# EAGLE board yacc1 (EAGLE 6.5.0)
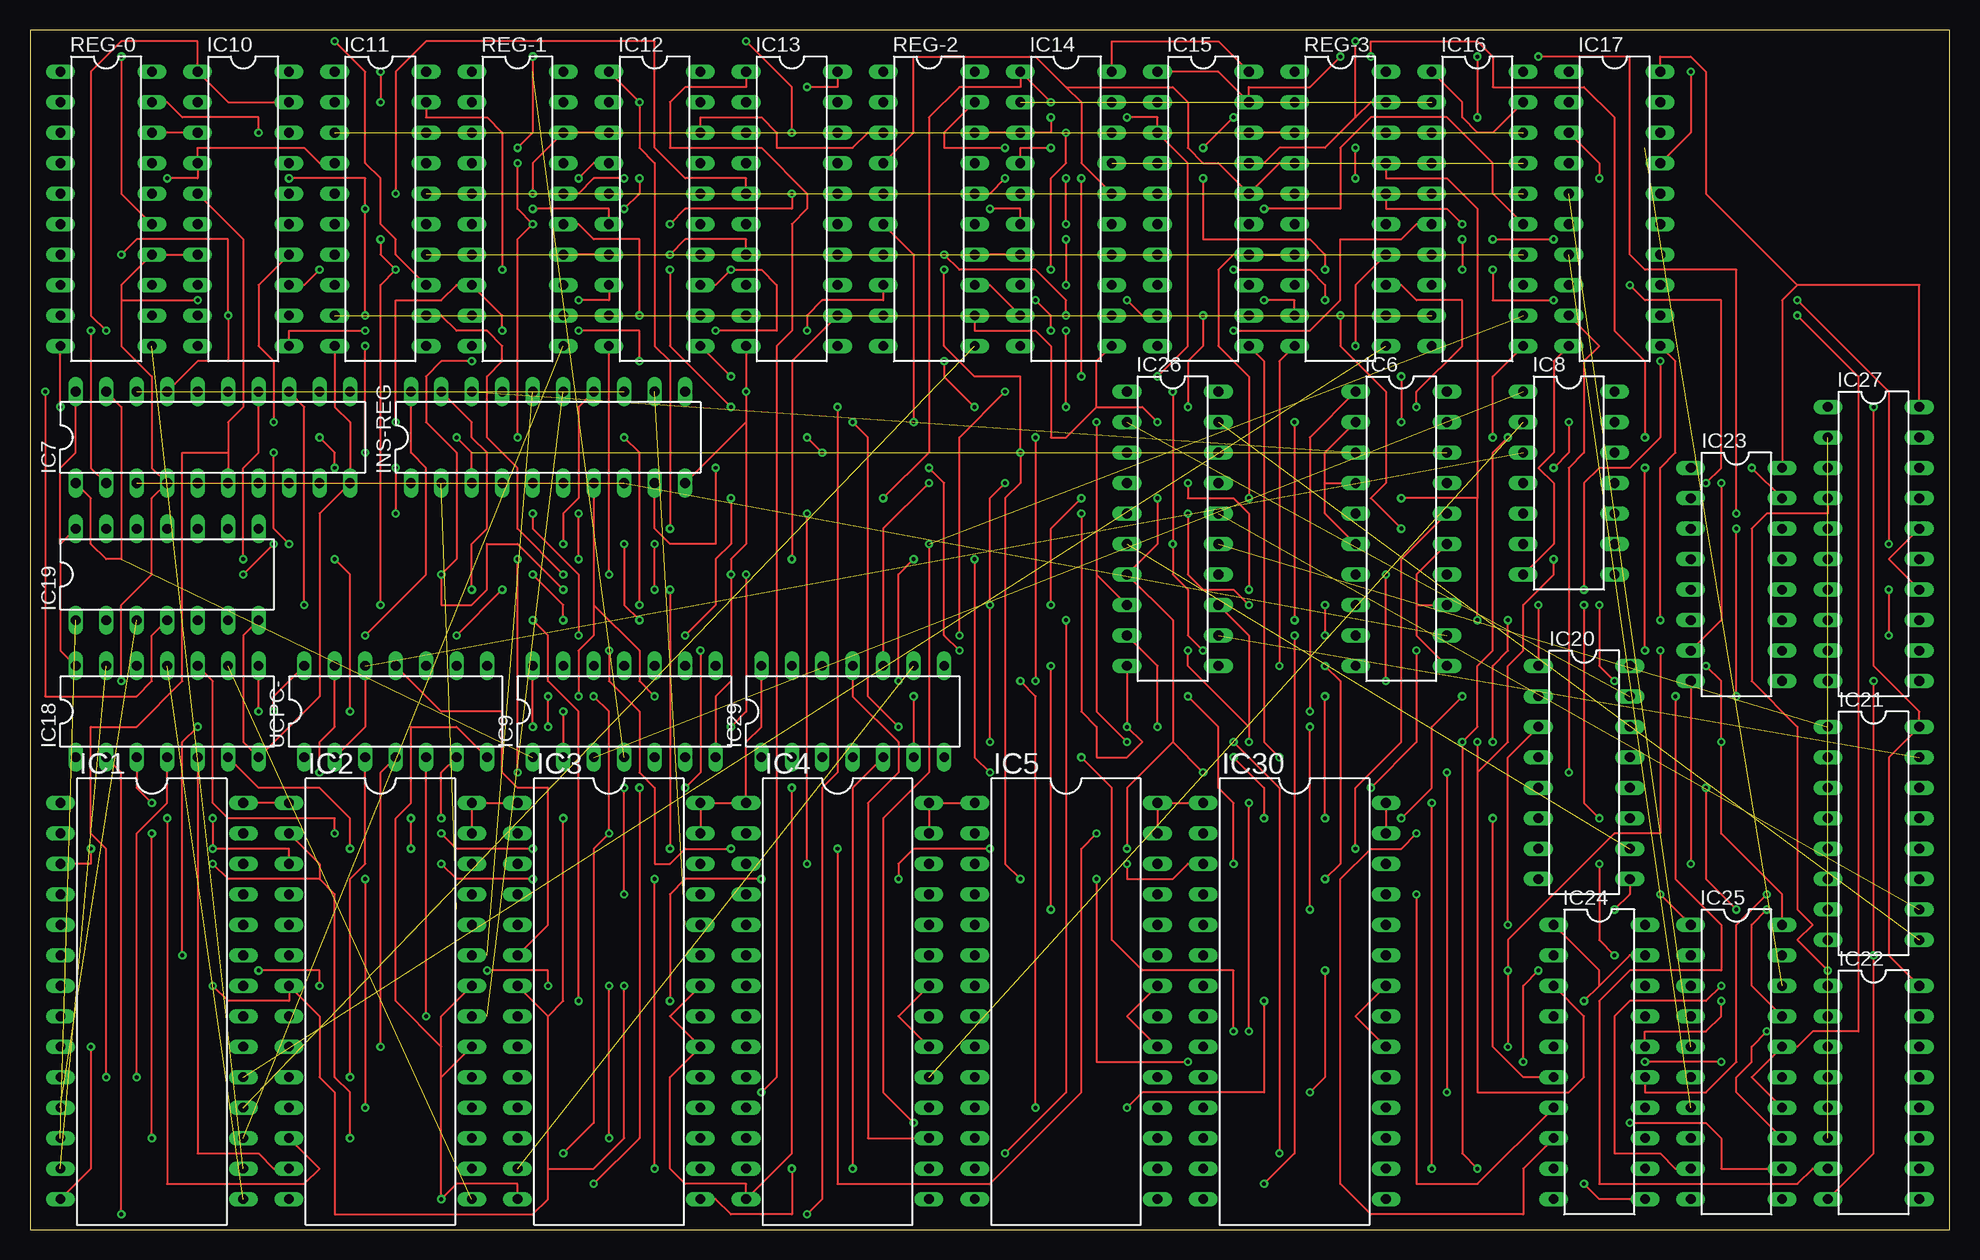
[diagram p3: board, top side]
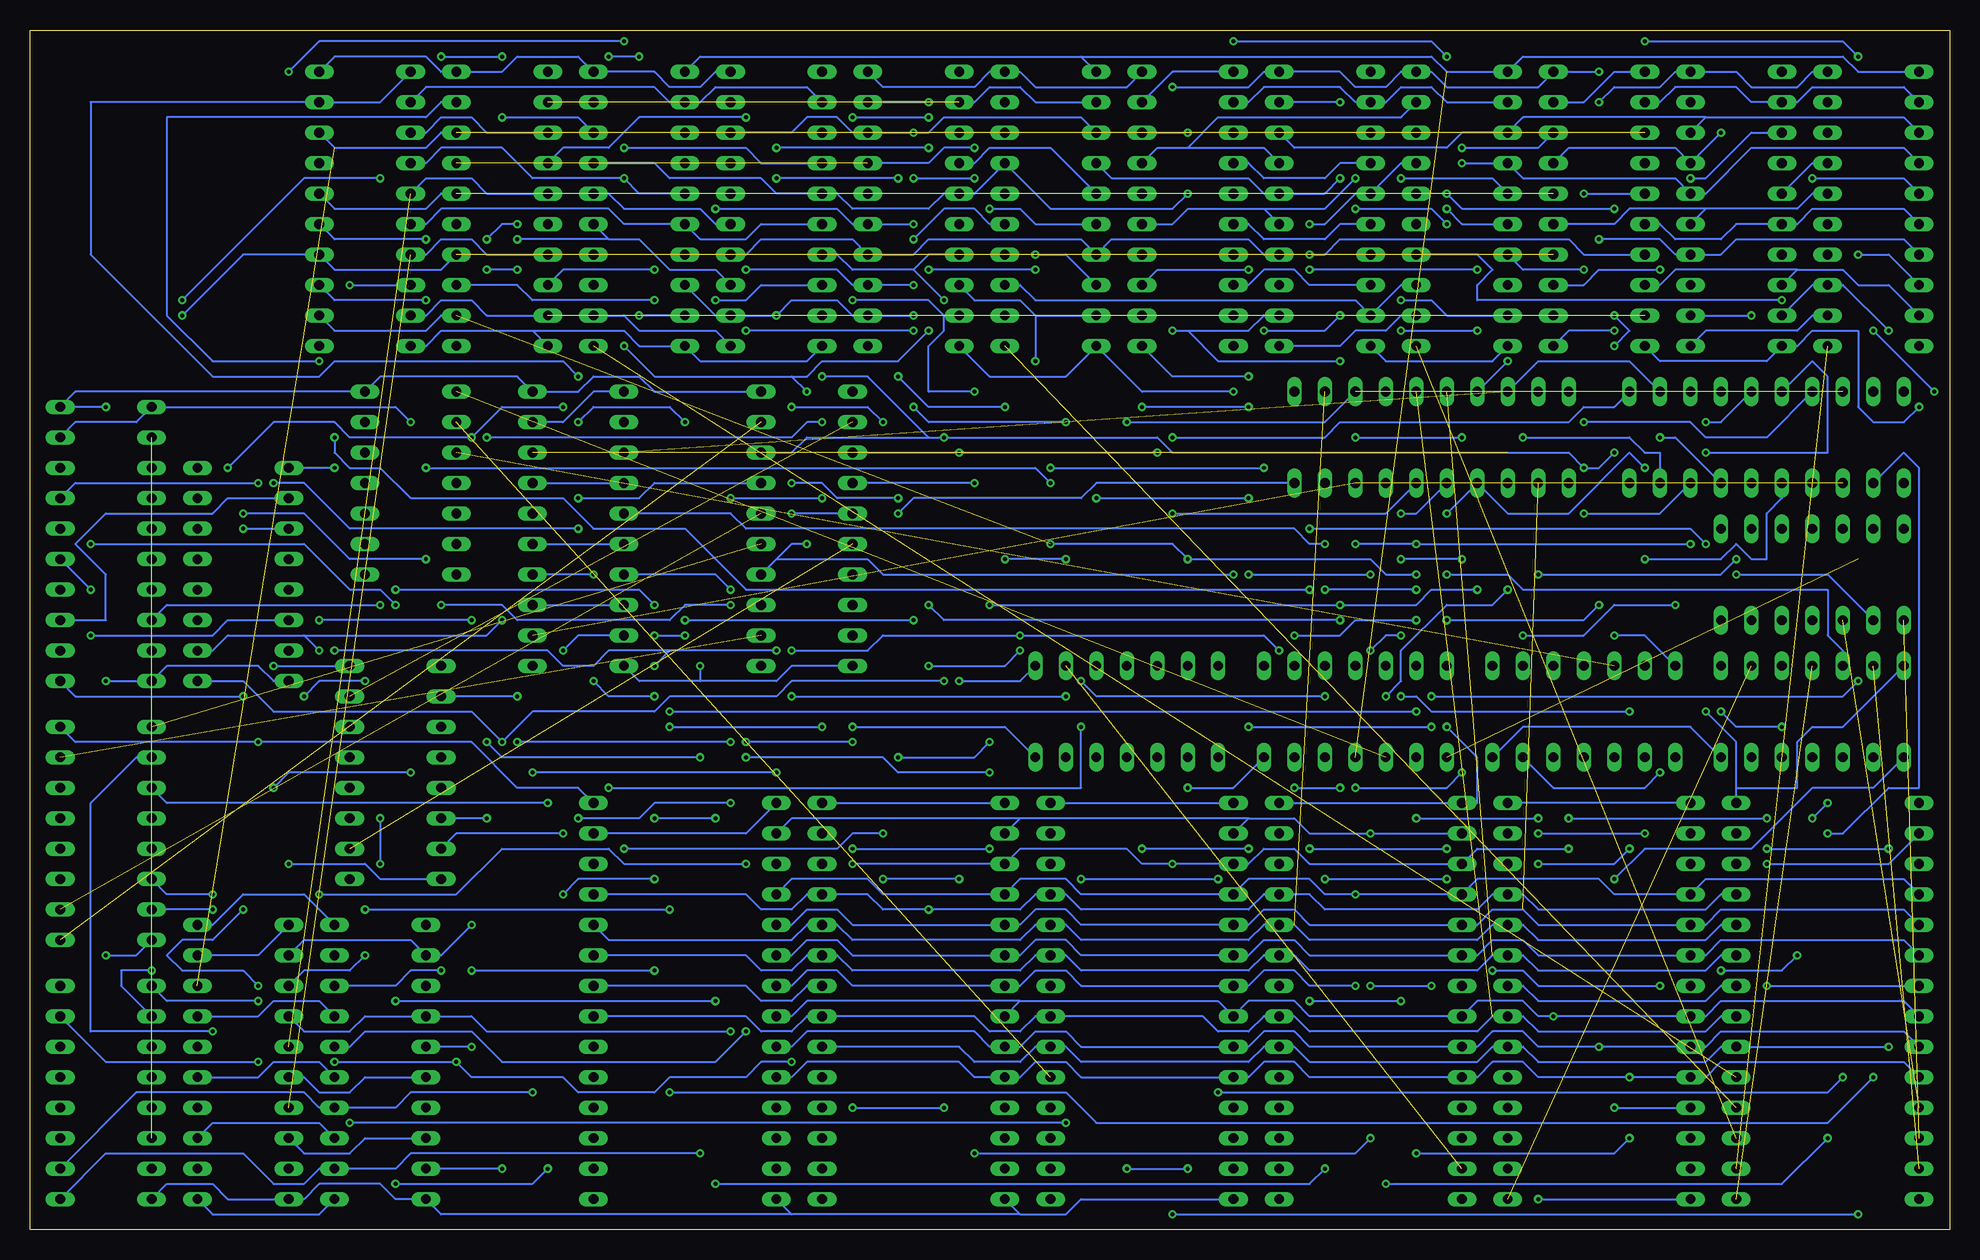
[diagram p4: board, bottom side, seen from below]

Size 160 x 100 mm. Coordinates in mm from the lower left corner, seen from the top.
Outline: 0,0 160,0 160,100 0,100 0,0
Copper layers (1*16): Top 0.0356mm / dielectric 1.5011mm / Bottom 0.0356mm
Design rules "oshpark-2layer": minimum track width 6mil, minimum drill 13mil, track to track 6mil, track to pad 6mil, pad to pad 6mil, via to via 6mil, smd to smd 6mil, copper to edge 15mil, drill to drill 6mil, minimum pad ring 7mil, minimum via ring 7mil, stop-mask expansion 4mil, vias tented up to drill 0mil, thermal gap 10mil

## Footprints (pad centres in the part's own frame; a part is rotated, then mirrored left to right if it is on the bottom)
DIL28-6 = drill 0.813 long: 1 -16.51,-7.62; 2 -13.97,-7.62; 3 -11.43,-7.62; 4 -8.89,-7.62; 5 -6.35,-7.62; 6 -3.81,-7.62; 7 -1.27,-7.62; 8 1.27,-7.62; 9 3.81,-7.62; 10 6.35,-7.62; 11 8.89,-7.62; 12 11.43,-7.62; 13 13.97,-7.62; 14 16.51,-7.62; 15 16.51,7.62; 16 13.97,7.62; 17 11.43,7.62; 18 8.89,7.62; 19 6.35,7.62; 20 3.81,7.62; 21 1.27,7.62; 22 -1.27,7.62; 23 -3.81,7.62; 24 -6.35,7.62; 25 -8.89,7.62; 26 -11.43,7.62; 27 -13.97,7.62; 28 -16.51,7.62
DIL20 = drill 0.813 long: 1 -11.43,-3.81; 2 -8.89,-3.81; 3 -6.35,-3.81; 4 -3.81,-3.81; 5 -1.27,-3.81; 6 1.27,-3.81; 7 3.81,-3.81; 8 6.35,-3.81; 9 8.89,-3.81; 10 11.43,-3.81; 11 11.43,3.81; 12 8.89,3.81; 13 6.35,3.81; 14 3.81,3.81; 15 1.27,3.81; 16 -1.27,3.81; 17 -3.81,3.81; 18 -6.35,3.81; 19 -8.89,3.81; 20 -11.43,3.81
DIL14 = drill 0.813 long: 1 -7.62,-3.81; 2 -5.08,-3.81; 3 -2.54,-3.81; 4 0,-3.81; 5 2.54,-3.81; 6 5.08,-3.81; 7 7.62,-3.81; 8 7.62,3.81; 9 5.08,3.81; 10 2.54,3.81; 11 0,3.81; 12 -2.54,3.81; 13 -5.08,3.81; 14 -7.62,3.81
DIL16 = drill 0.813 long: 1 -8.89,-3.81; 2 -6.35,-3.81; 3 -3.81,-3.81; 4 -1.27,-3.81; 5 1.27,-3.81; 6 3.81,-3.81; 7 6.35,-3.81; 8 8.89,-3.81; 9 8.89,3.81; 10 6.35,3.81; 11 3.81,3.81; 12 1.27,3.81; 13 -1.27,3.81; 14 -3.81,3.81; 15 -6.35,3.81; 16 -8.89,3.81

## Placement (x,y rotation side)
IC1  27C64P  [DIL28-6]  10.16,19.05 270 top
IC2  27C64P  [DIL28-6]  29.21,19.05 270 top
IC3  27C64P  [DIL28-6]  48.26,19.05 270 top
IC4  27C64P  [DIL28-6]  67.31,19.05 270 top
IC5  27C64P  [DIL28-6]  86.36,19.05 270 top
IC6  74LS244N  [DIL20]  114.3,58.42 270 top
IC7  74LS244N  [DIL20]  15.24,66.04 0 top
IC8  74LS32N  [DIL14]  128.27,62.23 270 top
IC9  74AS04N  [DIL14]  49.53,43.18 0 top
IC10  74LS244N  [DIL20]  17.78,85.09 270 top
IC11  74LS244N  [DIL20]  29.21,85.09 270 top
IC12  74LS244N  [DIL20]  52.07,85.09 270 top
IC13  74LS244N  [DIL20]  63.5,85.09 270 top
IC14  74LS244N  [DIL20]  86.36,85.09 270 top
IC15  74LS244N  [DIL20]  97.79,85.09 270 top
IC16  74LS244N  [DIL20]  120.65,85.09 270 top
IC17  74LS244N  [DIL20]  132.08,85.09 270 top
IC18  74ALS04N  [DIL14]  11.43,43.18 0 top
IC19  74ALS04N  [DIL14]  11.43,54.61 0 top
IC20  74LS191N  [DIL16]  129.54,38.1 270 top
IC21  74LS191N  [DIL16]  153.67,33.02 270 top
IC22  74LS191N  [DIL16]  153.67,11.43 270 top
IC23  74LS191N  [DIL16]  142.24,54.61 270 top
IC24  74LS244N  [DIL20]  130.81,13.97 270 top
IC25  74LS244N  [DIL20]  142.24,13.97 270 top
IC26  74273N  [DIL20]  95.25,58.42 270 top
IC27  74LS244N  [DIL20]  153.67,57.15 270 top
IC29  74LS04N  [DIL14]  68.58,43.18 0 top
IC30  27C64P  [DIL28-6]  105.41,19.05 270 top
INS-REG  74273N  [DIL20]  43.18,66.04 0 top
REG-0  74273N  [DIL20]  6.35,85.09 270 top
REG-1  74273N  [DIL20]  40.64,85.09 270 top
REG-2  74273N  [DIL20]  74.93,85.09 270 top
REG-3  74273N  [DIL20]  109.22,85.09 270 top
UCPC-  74AC393N  [DIL14]  30.48,43.18 0 top

## Tracks (layer width: path | path; a pad name or v marks a point on that pad's centre or on a via)
5V
  Top 0.152: IC6.2 107.95,64.77 107.95,62.23 | 107.95,62.23 107.95,59.69 IC6.6 | IC6.11 115.57,49.53 115.57,52.07 | 115.57,52.07 115.57,54.61 IC6.15 | 115.57,52.07 IC6.13 | 107.95,62.23 IC6.4
  Bottom 0.152: IC6.17 IC6.4 | IC6.13 IC6.8 | IC6.15 IC6.6
-DO-INT  (via drill 0.33)
  Top 0.152: v44.45,43.18 IC9.2 | v106.68,43.18 106.68,66.04 IC6.1
  Bottom 0.152: v106.68,43.18 v44.45,43.18 | IC6.19 115.57,67.31 113.03,69.85 IC6.1
-RESET  (1 unrouted)
  Bottom 0.152: REG-0.1 7.62,96.52 8.89,97.79 35.56,97.79 REG-1.1 41.91,96.52 43.18,97.79 72.39,97.79 | 72.39,97.79 REG-2.1 | 72.39,97.79 104.14,97.79 REG-3.1
ADDR0  (via drill 0.33)  (2 unrouted)
  Top 0.152: v40.64,90.17 41.91,91.44 v41.91,97.79 | v59.69,99.06 63.5,95.25 v63.5,91.44
  Bottom 0.152: IC16.18 125.73,91.44 127,90.17 134.62,90.17 IC17.18 | IC11.18 34.29,90.17 v40.64,90.17 | v41.91,97.79 43.18,99.06 v59.69,99.06 | IC13.18 v63.5,91.44
ADDR1  (2 unrouted)
  Bottom 0.152: IC16.16 125.73,86.36 127,85.09 134.62,85.09 IC17.16
ADDR2  (via drill 0.33)  (2 unrouted)
  Top 0.152: IC25.14 143.51,12.7 IC25.16 147.32,15.24 148.59,16.51 152.4,16.51 152.4,71.12 v147.32,76.2
  Bottom 0.152: IC16.14 125.73,80.01 134.62,80.01 IC17.14 142.24,81.28 v147.32,76.2
ADDR3  (via drill 0.33)  (1 unrouted)
  Top 0.152: IC11.12 34.29,76.2 35.56,74.93 38.1,74.93 39.37,73.66 39.37,72.39 38.1,71.12 38.1,66.04 40.64,63.5 40.64,58.42 v44.45,54.61 | v63.5,55.88 63.5,72.39 IC13.12 | IC25.12 140.97,5.08 140.97,7.62 139.7,8.89 v133.35,8.89 | v73.66,8.89 71.12,11.43 71.12,34.29 74.93,38.1 v74.93,57.15
  Bottom 0.152: v44.45,54.61 46.99,54.61 48.26,55.88 v63.5,55.88 64.77,57.15 v74.93,57.15 | v73.66,8.89 v133.35,8.89 | IC16.12 125.73,76.2 127,74.93 134.62,74.93 IC17.12
ADDR4  (via drill 0.33)  (2 unrouted)
  Top 0.152: IC25.9 137.16,5.08 135.89,6.35 132.08,6.35 132.08,17.78 133.35,19.05 139.7,19.05 v140.97,20.32 | v142.24,26.67 139.7,29.21 v139.7,36.83 | v128.27,38.1 128.27,63.5 129.54,64.77 129.54,72.39 130.81,73.66 IC17.9
  Bottom 0.152: IC16.9 121.92,76.2 123.19,77.47 125.73,77.47 127,76.2 IC17.9 | v140.97,20.32 142.24,21.59 147.32,21.59 148.59,22.86 147.32,24.13 144.78,24.13 v142.24,26.67 | v139.7,36.83 138.43,38.1 v128.27,38.1
ADDR5  (via drill 0.33)  (2 unrouted)
  Top 0.152: v53.34,81.28 54.61,82.55 59.69,82.55 IC13.7
  Bottom 0.152: IC16.7 121.92,81.28 123.19,82.55 125.73,82.55 127,81.28 IC17.7 | IC11.7 30.48,81.28 31.75,82.55 50.8,82.55 52.07,81.28 v53.34,81.28
ADDR6  (via drill 0.33)  (2 unrouted)
  Top 0.152: v30.48,86.36 30.48,96.52 33.02,99.06 52.07,99.06 52.07,90.17 54.61,87.63 59.69,87.63 IC13.5
  Bottom 0.152: IC16.5 121.92,86.36 123.19,87.63 127,87.63 IC17.5 | v30.48,86.36 IC11.5
ADDR7  (via drill 0.33)  (2 unrouted)
  Top 0.152: v132.08,22.86 130.81,24.13 v130.81,30.48 | v130.81,34.29 129.54,35.56 v129.54,52.07 | v154.94,57.15 154.94,69.85 v147.32,77.47 | v130.81,87.63 130.81,88.9 IC17.3
  Bottom 0.152: IC16.3 121.92,91.44 123.19,92.71 125.73,92.71 127,91.44 IC17.3 | IC25.3 137.16,21.59 133.35,21.59 v132.08,22.86 | v130.81,34.29 v130.81,30.48 | v129.54,52.07 130.81,53.34 133.35,53.34 137.16,57.15 v154.94,57.15 | v147.32,77.47 137.16,87.63 v130.81,87.63
ADDR9
  Top 0.152: IC27.14 154.94,55.88 IC27.16
BRANCH0  (1 unrouted)
BRANCH1  (via drill 0.33)
  Top 0.152: v125.73,52.07 IC20.1 | v101.6,52.07 100.33,53.34 97.79,53.34 96.52,54.61 v96.52,59.69
  Bottom 0.152: v125.73,52.07 120.65,52.07 119.38,50.8 106.68,50.8 105.41,52.07 v101.6,52.07 | IC26.5 v96.52,59.69
BRANCH2  (1 unrouted)
BRANCH3  (via drill 0.33)
  Top 0.152: IC26.9 93.98,46.99 v93.98,41.91 | v106.68,26.67 v106.68,41.91 | v132.08,26.67 133.35,27.94 IC20.9
  Bottom 0.152: v106.68,41.91 v93.98,41.91 | v132.08,26.67 v106.68,26.67
BRANCH4  (1 unrouted)
BRANCH5  (1 unrouted)
BRANCH6  (1 unrouted)
BRANCH7  (1 unrouted)
DATA0  (via drill 0.33)
  Top 0.152: REG-3.3 IC15.18 | REG-2.3 69.85,91.44 68.58,90.17 62.23,90.17 62.23,91.44 60.96,92.71 55.88,92.71 IC12.18 | v125.73,21.59 124.46,20.32 v124.46,13.97 | v140.97,13.97 v134.62,13.97 | v66.04,64.77 v64.77,66.04 | v96.52,13.97 88.9,13.97 v88.9,29.21 | v82.55,29.21 81.28,30.48 81.28,60.96 82.55,62.23 v82.55,64.77 82.55,71.12 78.74,71.12 76.2,73.66 v76.2,80.01 | v86.36,91.44 86.36,88.9 85.09,87.63 v85.09,80.01
  Bottom 0.152: REG-2.3 72.39,92.71 83.82,92.71 85.09,91.44 v86.36,91.44 IC14.18 91.44,91.44 92.71,92.71 95.25,92.71 96.52,91.44 IC15.18 | REG-0.3 3.81,92.71 20.32,92.71 | IC10.18 20.32,92.71 | 20.32,92.71 35.56,92.71 REG-1.3 40.64,91.44 41.91,90.17 54.61,90.17 IC12.18 | IC24.18 129.54,20.32 128.27,21.59 v125.73,21.59 | v134.62,13.97 v124.46,13.97 123.19,12.7 115.57,12.7 114.3,11.43 107.95,11.43 106.68,12.7 100.33,12.7 99.06,13.97 v96.52,13.97 | v140.97,13.97 153.67,13.97 IC22.15 | IC7.11 27.94,68.58 30.48,68.58 31.75,67.31 50.8,67.31 52.07,66.04 v64.77,66.04 | IC26.3 v82.55,64.77 v66.04,64.77 | v82.55,29.21 v88.9,29.21 | v76.2,80.01 v85.09,80.01
DATA1  (via drill 0.33)
  Top 0.152: REG-3.4 104.14,88.9 IC15.16 99.06,88.9 97.79,88.9 96.52,90.17 96.52,93.98 95.25,95.25 86.36,95.25 | IC14.16 87.63,88.9 87.63,93.98 86.36,95.25 | 86.36,95.25 83.82,97.79 73.66,97.79 73.66,91.44 REG-2.4 | v40.64,88.9 40.64,85.09 v41.91,83.82 40.64,82.55 v40.64,66.04 | v49.53,85.09 50.8,86.36 v50.8,87.63 | v81.28,62.23 80.01,60.96 v80.01,52.07 v80.01,40.64 | v87.63,39.37 90.17,36.83 90.17,24.13 92.71,21.59 100.33,21.59 v100.33,16.51 | IC7.13 22.86,68.58 v22.86,52.07 | v39.37,53.34 v35.56,49.53 | v140.97,19.05 140.97,17.78 139.7,16.51 134.62,16.51 IC24.16 | v49.53,66.04 50.8,64.77 v50.8,52.07
  Bottom 0.152: REG-0.4 3.81,90.17 16.51,90.17 20.32,86.36 IC10.16 22.86,87.63 35.56,87.63 REG-1.4 v40.64,88.9 | REG-2.4 69.85,87.63 58.42,87.63 57.15,86.36 IC12.16 52.07,86.36 v50.8,87.63 | v41.91,83.82 43.18,85.09 v49.53,85.09 | v81.28,62.23 IC26.4 | v80.01,40.64 81.28,39.37 v87.63,39.37 | v100.33,16.51 102.87,13.97 120.65,13.97 123.19,16.51 132.08,16.51 133.35,15.24 IC24.16 | v22.86,52.07 27.94,52.07 30.48,49.53 v35.56,49.53 | v39.37,53.34 43.18,53.34 44.45,52.07 v50.8,52.07 v80.01,52.07 | IC22.1 148.59,19.05 v140.97,19.05 | v49.53,66.04 v40.64,66.04
DATA2  (via drill 0.33)
  Top 0.152: v20.32,67.31 20.32,72.39 19.05,73.66 19.05,78.74 IC10.14 | v29.21,82.55 29.21,81.28 v30.48,80.01 29.21,78.74 v29.21,52.07 | v93.98,60.96 93.98,57.15 IC26.7 95.25,50.8 95.25,40.64 | v101.6,60.96 101.6,71.12 99.06,73.66 99.06,80.01 100.33,81.28 IC15.14 REG-3.7 | v118.11,38.1 v118.11,11.43 | 95.25,40.64 v97.79,38.1 | v41.91,50.8 43.18,49.53 43.18,45.72 45.72,43.18 v45.72,19.05 | v53.34,19.05 53.34,27.94 54.61,29.21 v60.96,29.21 | v72.39,29.21 72.39,30.48 73.66,31.75 v80.01,31.75 | v91.44,31.75 91.44,36.83 95.25,40.64
  Bottom 0.152: IC7.15 19.05,67.31 v20.32,67.31 | REG-0.7 3.81,82.55 17.78,82.55 19.05,81.28 IC10.14 22.86,81.28 24.13,82.55 v29.21,82.55 | REG-1.7 35.56,80.01 v30.48,80.01 | IC22.10 151.13,11.43 137.16,11.43 135.89,10.16 IC24.14 129.54,10.16 128.27,11.43 v118.11,11.43 | IC12.14 57.15,81.28 58.42,82.55 69.85,82.55 REG-2.7 72.39,82.55 85.09,82.55 86.36,81.28 IC14.14 91.44,82.55 99.06,82.55 100.33,81.28 IC15.14 | v101.6,60.96 v93.98,60.96 | v97.79,38.1 v118.11,38.1 | v29.21,52.07 30.48,50.8 v41.91,50.8 | v53.34,19.05 v45.72,19.05 | v72.39,29.21 v60.96,29.21 | v91.44,31.75 v80.01,31.75
DATA3  (via drill 0.33)
  Top 0.152: IC7.17 13.97,72.39 16.51,72.39 v16.51,76.2 16.51,82.55 8.89,82.55 v7.62,81.28 | v30.48,67.31 30.48,77.47 34.29,77.47 35.56,78.74 REG-1.8 39.37,76.2 v39.37,74.93 | v64.77,74.93 64.77,76.2 66.04,77.47 71.12,77.47 REG-2.8 | 88.9,54.61 IC26.8 | v88.9,67.31 88.9,54.61 | v96.52,68.58 96.52,72.39 97.79,73.66 v97.79,76.2 | v76.2,81.28 77.47,80.01 83.82,80.01 86.36,77.47 v86.36,76.2 | v104.14,6.35 104.14,36.83 v100.33,40.64 | v91.44,40.64 88.9,43.18 88.9,54.61 | v45.72,74.93 50.8,74.93 v50.8,72.39
  Bottom 0.152: IC10.12 v16.51,76.2 | REG-0.8 5.08,81.28 v7.62,81.28 | v30.48,67.31 21.59,67.31 20.32,66.04 15.24,66.04 IC7.17 | IC22.9 153.67,6.35 142.24,6.35 139.7,3.81 137.16,3.81 135.89,5.08 IC24.12 129.54,5.08 128.27,6.35 v104.14,6.35 | IC12.12 57.15,76.2 58.42,74.93 63.5,74.93 | v64.77,74.93 63.5,74.93 | v88.9,67.31 90.17,68.58 v96.52,68.58 | REG-3.8 102.87,76.2 IC15.12 v97.79,76.2 96.52,77.47 92.71,77.47 91.44,76.2 IC14.12 v86.36,76.2 | REG-2.8 73.66,81.28 v76.2,81.28 | v91.44,40.64 v100.33,40.64 | v45.72,74.93 v39.37,74.93 | v50.8,72.39 60.96,72.39 63.5,74.93
DATA4  (via drill 0.33)
  Top 0.152: IC14.9 80.01,78.74 REG-2.13 | IC15.9 92.71,76.2 v91.44,77.47 | IC7.2 5.08,63.5 v5.08,74.93 | v120.65,5.08 119.38,6.35 v119.38,40.64 120.65,41.91 120.65,46.99 121.92,48.26 121.92,64.77 v123.19,66.04 | 101.6,41.91 101.6,49.53 IC26.13 | 101.6,41.91 v101.6,40.64 | v143.51,63.5 IC23.15 | REG-3.13 114.3,78.74 115.57,77.47 119.38,77.47 119.38,73.66 115.57,69.85 v115.57,68.58 | v10.16,7.62 v10.16,33.02 | v46.99,3.81 50.8,7.62 v50.8,36.83 | v54.61,36.83 55.88,38.1 v55.88,48.26 | v96.52,48.26 96.52,46.99 101.6,41.91 | v81.28,69.85 77.47,66.04 v77.47,49.53
  Bottom 0.152: REG-1.13 45.72,78.74 IC12.9 49.53,77.47 76.2,77.47 77.47,78.74 REG-2.13 | v91.44,77.47 85.09,77.47 83.82,76.2 | IC14.9 83.82,76.2 | v5.08,74.93 8.89,78.74 REG-0.13 11.43,78.74 IC10.9 | v120.65,5.08 IC24.9 | v101.6,40.64 v119.38,40.64 | v143.51,63.5 139.7,67.31 134.62,67.31 133.35,66.04 v123.19,66.04 120.65,68.58 v115.57,68.58 | IC7.2 3.81,64.77 2.54,63.5 2.54,36.83 5.08,36.83 8.89,33.02 v10.16,33.02 | v10.16,7.62 13.97,3.81 v46.99,3.81 | v54.61,36.83 v50.8,36.83 | v55.88,48.26 57.15,49.53 v77.47,49.53 88.9,49.53 90.17,48.26 v96.52,48.26 | 83.82,76.2 83.82,74.93 85.09,73.66 85.09,69.85 v81.28,69.85
DATA5  (via drill 0.33)
  Top 0.152: IC12.7 REG-1.14 | 7.62,77.47 7.62,78.74 REG-0.14 IC10.7 | 7.62,77.47 7.62,73.66 10.16,71.12 10.16,63.5 IC7.4 10.16,60.96 10.16,54.61 7.62,52.07 v7.62,45.72 | 7.62,77.47 v13.97,77.47 | IC14.7 REG-2.14 | v95.25,69.85 v95.25,57.15 95.25,54.61 96.52,53.34 96.52,49.53 v97.79,48.26 | v110.49,73.66 110.49,78.74 REG-3.14 | IC24.7 120.65,3.81 115.57,3.81 v115.57,27.94 | v107.95,29.21 109.22,30.48 109.22,45.72 v107.95,46.99 | v134.62,48.26 v134.62,63.5 | v83.82,77.47 85.09,76.2 v85.09,74.93 | v43.18,41.91 v43.18,44.45 | v58.42,41.91 59.69,43.18 v59.69,54.61
  Bottom 0.152: REG-1.14 39.37,81.28 38.1,80.01 39.37,78.74 39.37,77.47 v13.97,77.47 | IC15.7 92.71,81.28 91.44,80.01 86.36,80.01 | 86.36,80.01 85.09,81.28 IC14.7 | 97.79,55.88 96.52,57.15 v95.25,57.15 | 97.79,55.88 IC26.14 | 96.52,71.12 v95.25,69.85 | 96.52,71.12 107.95,71.12 v110.49,73.66 | v115.57,27.94 114.3,29.21 v107.95,29.21 | 106.68,48.26 v107.95,46.99 | v97.79,48.26 106.68,48.26 | v134.62,63.5 IC23.1 | v134.62,48.26 116.84,48.26 115.57,46.99 113.03,46.99 111.76,48.26 106.68,48.26 | v83.82,77.47 86.36,80.01 | v85.09,74.93 87.63,72.39 93.98,72.39 95.25,71.12 96.52,71.12 | v7.62,45.72 8.89,44.45 v43.18,44.45 | v58.42,41.91 v43.18,41.91 | v59.69,54.61 88.9,54.61 90.17,55.88 97.79,55.88
DATA6  (via drill 0.33)
  Top 0.152: 120.65,60.96 v114.3,60.96 | 120.65,60.96 120.65,85.09 118.11,87.63 113.03,87.63 REG-3.17 | v53.34,83.82 54.61,85.09 63.5,85.09 v63.5,86.36 | 16.51,64.77 16.51,67.31 17.78,68.58 17.78,82.55 IC10.5 | 16.51,64.77 IC7.6 | v123.19,15.24 v123.19,21.59 123.19,24.13 132.08,33.02 135.89,33.02 v135.89,48.26 | 16.51,64.77 12.7,64.77 12.7,45.72 8.89,41.91 5.08,41.91 5.08,33.02 6.35,31.75 v6.35,12.7 | v106.68,11.43 107.95,12.7 v107.95,21.59 | v120.65,50.8 120.65,60.96
  Bottom 0.152: IC26.17 107.95,62.23 109.22,60.96 v114.3,60.96 | REG-1.17 45.72,88.9 IC12.5 49.53,86.36 52.07,83.82 v53.34,83.82 | v63.5,86.36 64.77,85.09 74.93,85.09 REG-2.17 81.28,86.36 IC14.5 83.82,86.36 85.09,85.09 91.44,85.09 92.71,86.36 IC15.5 97.79,86.36 99.06,87.63 106.68,87.63 107.95,88.9 REG-3.17 | REG-0.17 11.43,88.9 IC10.5 | v123.19,15.24 IC24.5 | 137.16,49.53 v135.89,48.26 | 137.16,49.53 143.51,49.53 144.78,48.26 IC23.10 | v6.35,12.7 10.16,8.89 71.12,8.89 73.66,11.43 v106.68,11.43 | v123.19,21.59 v107.95,21.59 | v120.65,50.8 121.92,49.53 137.16,49.53
DATA7  (via drill 0.33)
  Top 0.152: IC24.3 129.54,17.78 129.54,12.7 128.27,11.43 120.65,11.43 120.65,38.1 | v120.65,40.64 120.65,38.1 | v120.65,97.79 v120.65,92.71 | v125.73,97.79 133.35,97.79 133.35,81.28 134.62,80.01 142.24,80.01 v142.24,59.69 | v127,55.88 127,54.61 124.46,52.07 124.46,48.26 123.19,46.99 123.19,40.64 120.65,38.1 | IC10.3 REG-0.18 | IC12.3 REG-1.18 41.91,88.9 v41.91,86.36 | v21.59,87.63 27.94,87.63 v27.94,85.09 v27.94,76.2 | REG-2.18 IC14.3 85.09,91.44 v85.09,92.71 | v30.48,63.5 v30.48,59.69 | v93.98,71.12 96.52,73.66 96.52,88.9 IC15.3 93.98,92.71 v91.44,92.71 | v27.94,64.77 v27.94,73.66 | v83.82,66.04 v83.82,45.72
  Bottom 0.152: IC23.9 142.24,45.72 139.7,43.18 123.19,43.18 v120.65,40.64 118.11,43.18 107.95,43.18 106.68,44.45 97.79,44.45 96.52,45.72 v83.82,45.72 | REG-3.18 114.3,92.71 v120.65,92.71 | v125.73,97.79 v120.65,97.79 | v142.24,59.69 137.16,59.69 133.35,55.88 v127,55.88 | IC10.3 16.51,91.44 20.32,87.63 v21.59,87.63 | v27.94,85.09 40.64,85.09 v41.91,86.36 | IC7.8 24.13,59.69 v30.48,59.69 | 85.09,66.04 95.25,66.04 96.52,64.77 IC26.18 | 85.09,66.04 v83.82,66.04 66.04,66.04 64.77,64.77 31.75,64.77 v30.48,63.5 29.21,63.5 v27.94,64.77 | v93.98,71.12 90.17,71.12 85.09,66.04 | v91.44,92.71 v85.09,92.71 | v27.94,76.2 26.67,74.93 v27.94,73.66
DINS0  (via drill 0.33)  (1 unrouted)
  Top 0.152: v35.56,66.04 36.83,64.77 INS-REG.3
  Bottom 0.152: IC7.9 24.13,64.77 25.4,64.77 26.67,66.04 v35.56,66.04
DINS1  (via drill 0.33)
  Top 0.152: v24.13,66.04 25.4,64.77 v25.4,63.5 | IC6.16 114.3,55.88 114.3,40.64 110.49,36.83 v110.49,31.75 | v88.9,33.02 87.63,31.75 87.63,11.43 80.01,3.81 67.31,3.81 v67.31,31.75 | v58.42,31.75 54.61,31.75 53.34,30.48 52.07,30.48 52.07,36.83 50.8,38.1 50.8,43.18 48.26,45.72 v48.26,48.26 | v45.72,49.53 45.72,54.61 41.91,58.42 v41.91,59.69
  Bottom 0.152: IC7.7 22.86,66.04 v24.13,66.04 | v25.4,63.5 26.67,64.77 31.75,59.69 36.83,59.69 INS-REG.4 v41.91,59.69 | v110.49,31.75 92.71,31.75 91.44,33.02 v88.9,33.02 | v58.42,31.75 v67.31,31.75 | v48.26,48.26 46.99,49.53 v45.72,49.53
DINS2  (via drill 0.33)
  Top 0.152: v25.4,55.88 26.67,54.61 v26.67,43.18 | v45.72,44.45 45.72,48.26 46.99,49.53 46.99,52.07 | INS-REG.7 46.99,52.07 | v113.03,45.72 v113.03,54.61 | v107.95,34.29 v107.95,44.45 | v102.87,34.29 102.87,36.83 v100.33,39.37 | v80.01,38.1 78.74,39.37 v78.74,55.88 | v73.66,55.88 72.39,54.61 v72.39,45.72 | v52.07,44.45 50.8,45.72 50.8,48.26 46.99,52.07
  Bottom 0.152: IC7.5 13.97,60.96 15.24,59.69 15.24,55.88 16.51,55.88 17.78,57.15 19.05,55.88 v25.4,55.88 | v26.67,43.18 43.18,43.18 44.45,44.45 v45.72,44.45 | v113.03,54.61 IC6.14 | v113.03,45.72 111.76,44.45 v107.95,44.45 | v102.87,34.29 v107.95,34.29 | v100.33,39.37 88.9,39.37 87.63,38.1 v80.01,38.1 | v73.66,55.88 v78.74,55.88 | v72.39,45.72 71.12,44.45 v52.07,44.45
DINS3  (2 unrouted)
DINS4  (via drill 0.33)  (1 unrouted)
  Top 0.152: v68.58,67.31 69.85,66.04 69.85,44.45 v72.39,41.91 | v111.76,36.83 115.57,40.64 v115.57,48.26
  Bottom 0.152: INS-REG.13 52.07,67.31 v68.58,67.31 | v72.39,41.91 72.39,36.83 v111.76,36.83 | v115.57,48.26 114.3,49.53 IC6.9
DINS5  (via drill 0.33)
  Top 0.152: v20.32,64.77 20.32,58.42 v21.59,57.15 | v44.45,57.15 44.45,59.69 45.72,60.96 45.72,68.58 INS-REG.14 | v101.6,53.34 101.6,59.69 100.33,60.96 96.52,60.96 v96.52,62.23 | v87.63,60.96 85.09,58.42 v85.09,52.07 | v50.8,50.8 49.53,52.07 v49.53,57.15
  Bottom 0.152: IC7.16 11.43,72.39 10.16,71.12 10.16,64.77 v20.32,64.77 | v21.59,57.15 v44.45,57.15 v49.53,57.15 | IC6.7 102.87,54.61 v101.6,53.34 | v96.52,62.23 93.98,62.23 92.71,60.96 v87.63,60.96 | v85.09,52.07 83.82,50.8 v50.8,50.8
DINS6  (via drill 0.33)
  Top 0.152: IC7.14 19.05,64.77 17.78,63.5 v17.78,55.88 | v36.83,72.39 34.29,72.39 33.02,71.12 33.02,67.31 35.56,64.77 35.56,55.88 v34.29,54.61 34.29,52.07 36.83,52.07 38.1,53.34 38.1,57.15 40.64,57.15 v44.45,53.34 | v52.07,53.34 v52.07,57.15
  Bottom 0.152: v17.78,55.88 19.05,54.61 v34.29,54.61 | INS-REG.17 v36.83,72.39 | IC6.5 101.6,59.69 100.33,58.42 54.61,58.42 53.34,57.15 v52.07,57.15 | v44.45,53.34 v52.07,53.34
DINS7  (1 unrouted)
  Bottom 0.152: IC7.12 26.67,72.39 34.29,72.39 INS-REG.18
DO-INT  (1 unrouted)
  Top 0.152: IC7.1 5.08,60.96 5.08,57.15 6.35,55.88 7.62,55.88 7.62,68.58 IC7.19
GND  (via drill 0.33)
  Top 0.152: IC26.10 v91.44,41.91 92.71,40.64 91.44,39.37 88.9,39.37 88.9,41.91 87.63,43.18 v87.63,59.69 | IC8.7 127,57.15 127,62.23 125.73,63.5 127,64.77 127,72.39 IC17.10 | v104.14,46.99 104.14,72.39 REG-3.10 | IC9.7 57.15,44.45 58.42,45.72 v58.42,54.61 58.42,55.88 59.69,57.15 59.69,67.31 | IC13.10 v59.69,69.85 59.69,67.31 | 59.69,67.31 INS-REG.10 | v48.26,54.61 IC12.10 | IC19.7 17.78,49.53 17.78,40.64 IC18.7 24.13,44.45 24.13,59.69 IC7.10 26.67,67.31 25.4,68.58 IC11.10 | v2.54,68.58 REG-0.10 | IC1.14 5.08,5.08 v5.08,15.24 | IC3.14 40.64,3.81 35.56,3.81 v34.29,2.54 34.29,12.7 | 34.29,12.7 IC2.20 | IC2.22 34.29,17.78 34.29,15.24 | 34.29,12.7 34.29,15.24 | IC23.8 v138.43,30.48 | IC22.8 153.67,6.35 v153.67,22.86 v153.67,45.72 | IC30.20 110.49,17.78 IC30.22 | IC5.20 91.44,17.78 IC5.22 | IC4.20 72.39,17.78 IC4.22 | IC3.22 53.34,17.78 IC3.20 53.34,12.7 53.34,5.08 54.61,3.81 59.69,3.81 IC4.14 63.5,6.35 v63.5,36.83 | UCPC-.7 35.56,41.91 31.75,41.91 31.75,35.56 30.48,34.29 30.48,19.05 34.29,15.24
  Bottom 0.152: IC29.7 78.74,41.91 v91.44,41.91 | IC6.10 109.22,45.72 104.14,45.72 | 104.14,45.72 97.79,45.72 96.52,46.99 IC26.10 | IC15.10 95.25,72.39 104.14,72.39 REG-3.10 109.22,73.66 110.49,74.93 118.11,74.93 | 118.11,74.93 IC16.10 | 118.11,74.93 125.73,74.93 127,73.66 IC17.10 | v104.14,46.99 104.14,45.72 | IC14.10 80.01,71.12 73.66,71.12 REG-2.10 67.31,69.85 v59.69,69.85 | REG-1.10 38.1,72.39 46.99,72.39 IC12.10 | v58.42,54.61 v48.26,54.61 | UCPC-.7 35.56,41.91 21.59,41.91 IC18.7 | v2.54,68.58 3.81,67.31 6.35,67.31 7.62,68.58 7.62,74.93 11.43,74.93 12.7,73.66 IC10.10 15.24,72.39 24.13,72.39 IC11.10 | v5.08,15.24 IC1.20 19.05,15.24 20.32,13.97 34.29,13.97 35.56,15.24 IC2.20 38.1,15.24 39.37,13.97 53.34,13.97 54.61,15.24 IC3.20 57.15,15.24 58.42,13.97 72.39,13.97 73.66,15.24 IC4.20 76.2,15.24 77.47,13.97 81.28,13.97 82.55,15.24 IC5.20 | IC1.22 19.05,20.32 20.32,19.05 34.29,19.05 35.56,20.32 IC2.22 | v34.29,2.54 IC2.14 | IC20.8 130.81,29.21 132.08,30.48 v138.43,30.48 | IC23.8 139.7,45.72 140.97,46.99 148.59,46.99 IC27.10 v153.67,45.72 | IC22.8 148.59,3.81 144.78,3.81 143.51,2.54 IC25.10 137.16,2.54 135.89,3.81 130.81,3.81 129.54,2.54 IC24.10 125.73,1.27 96.52,1.27 | IC21.8 151.13,22.86 v153.67,22.86 | IC4.14 72.39,2.54 73.66,1.27 77.47,1.27 | IC5.14 77.47,1.27 | 96.52,1.27 IC30.14 | 77.47,1.27 96.52,1.27 | IC30.22 100.33,20.32 99.06,19.05 96.52,19.05 95.25,20.32 IC5.22 | IC9.7 59.69,36.83 v63.5,36.83 | v87.63,59.69 86.36,60.96 72.39,60.96 71.12,62.23 INS-REG.10
N$1  (1 unrouted)
  Top 0.152: UCPC-.2 27.94,41.91 UCPC-.12
N$2  (via drill 0.33)
  Top 0.152: IC18.2 7.62,38.1 v7.62,1.27 | v64.77,1.27 66.04,2.54 66.04,36.83 67.31,38.1 v67.31,68.58 | v58.42,68.58 53.34,73.66 v53.34,80.01 | v39.37,80.01 39.37,91.44 38.1,92.71 33.02,92.71 IC11.19
  Bottom 0.152: v64.77,1.27 v7.62,1.27 | v58.42,68.58 v67.31,68.58 | v39.37,80.01 v53.34,80.01 | IC11.1 27.94,96.52 30.48,93.98 IC11.19
N$3  (via drill 0.33)
  Top 0.152: IC18.4 11.43,35.56 8.89,33.02 v8.89,12.7 | v60.96,11.43 62.23,12.7 62.23,73.66 63.5,74.93 63.5,83.82 64.77,85.09 64.77,86.36 60.96,90.17 53.34,90.17 53.34,93.98 54.61,95.25 59.69,95.25 IC13.1
  Bottom 0.152: v8.89,12.7 10.16,11.43 v60.96,11.43 | IC13.19 64.77,96.52 IC13.1
N$4  (via drill 0.33)
  Top 0.152: IC18.6 19.05,36.83 24.13,36.83 26.67,34.29 v26.67,31.75 | v34.29,30.48 35.56,29.21 v41.91,29.21 | v52.07,5.08 v52.07,29.21 | v102.87,3.81 105.41,6.35 v105.41,49.53 | v107.95,52.07 v107.95,49.53 | v129.54,53.34 129.54,62.23 130.81,63.5 133.35,63.5 135.89,66.04 v135.89,72.39 | IC16.1 119.38,93.98 119.38,92.71 120.65,91.44 121.92,91.44 IC16.19
  Bottom 0.152: v26.67,31.75 27.94,30.48 v34.29,30.48 | v52.07,29.21 v41.91,29.21 | v52.07,5.08 53.34,3.81 v102.87,3.81 | v107.95,49.53 v105.41,49.53 | v107.95,52.07 109.22,53.34 v129.54,53.34 | v135.89,72.39 144.78,72.39 148.59,76.2 148.59,92.71 127,92.71 125.73,93.98 IC16.19
N$5  (via drill 0.33)
  Top 0.152: v19.05,43.18 IC18.8 | v13.97,41.91 12.7,40.64 v12.7,22.86 | v19.05,21.59 24.13,21.59 v24.13,20.32 | v38.1,21.59 43.18,21.59 v43.18,20.32 | v48.26,7.62 v48.26,20.32 | v81.28,6.35 86.36,11.43 v86.36,50.8 | v105.41,67.31 v105.41,50.8 | v114.3,71.12 v114.3,67.31
  Bottom 0.152: v19.05,43.18 17.78,41.91 v13.97,41.91 | v12.7,22.86 13.97,21.59 v19.05,21.59 | v24.13,20.32 34.29,20.32 35.56,21.59 v38.1,21.59 | v48.26,20.32 v43.18,20.32 | v48.26,7.62 49.53,6.35 v81.28,6.35 | v105.41,50.8 v86.36,50.8 | v105.41,67.31 106.68,68.58 113.03,68.58 v114.3,67.31 | v114.3,71.12 115.57,72.39 134.62,72.39 135.89,71.12 144.78,71.12 154.94,81.28 154.94,93.98 IC17.19 130.81,93.98 IC17.1
N$6  (via drill 0.33)
  Top 0.152: IC19.4 10.16,49.53 10.16,45.72 8.89,44.45 1.27,44.45 v1.27,69.85 | v6.35,74.93 5.08,76.2 5.08,96.52 7.62,99.06 13.97,99.06 IC10.1 16.51,93.98 IC10.19
  Bottom 0.152: v6.35,74.93 v1.27,69.85
N$7  (via drill 0.33)
  Top 0.152: v20.32,57.15 v17.78,54.61 | v53.34,58.42 53.34,72.39 52.07,73.66 52.07,88.9 50.8,90.17 v50.8,93.98 IC12.1
  Bottom 0.152: IC19.2 10.16,54.61 v17.78,54.61 | v20.32,57.15 21.59,58.42 v53.34,58.42 | v50.8,93.98 IC12.19
N$8  (via drill 0.33)
  Top 0.152: v41.91,54.61 44.45,52.07 v44.45,50.8 | v54.61,49.53 57.15,52.07 57.15,55.88 58.42,57.15 v58.42,60.96 | v71.12,60.96 74.93,64.77 74.93,92.71 77.47,95.25 82.55,95.25 IC14.1 v85.09,93.98
  Bottom 0.152: IC18.12 8.89,48.26 10.16,49.53 10.16,53.34 35.56,53.34 36.83,54.61 v41.91,54.61 | v44.45,50.8 49.53,50.8 50.8,49.53 v54.61,49.53 | v71.12,60.96 v58.42,60.96 | v85.09,93.98 IC14.19
N$9  (via drill 0.33)
  Top 0.152: IC18.10 15.24,45.72 15.24,35.56 16.51,34.29 25.4,34.29 v25.4,33.02 | v34.29,33.02 35.56,31.75 v41.91,31.75 | v53.34,53.34 v53.34,31.75 | v134.62,66.04 134.62,72.39 132.08,74.93 132.08,92.71 129.54,95.25 121.92,95.25 121.92,97.79 120.65,99.06 111.76,99.06 v111.76,97.79 | v109.22,97.79 106.68,95.25 101.6,95.25 IC15.19 99.06,96.52 IC15.1
  Bottom 0.152: v34.29,33.02 v25.4,33.02 | v53.34,31.75 v41.91,31.75 | v53.34,53.34 100.33,53.34 105.41,58.42 113.03,58.42 115.57,60.96 128.27,60.96 130.81,63.5 133.35,63.5 134.62,64.77 v134.62,66.04 | v109.22,97.79 v111.76,97.79
N$10  (1 unrouted)
N$11  (via drill 0.33)
  Top 0.152: v149.86,21.59 147.32,24.13 148.59,25.4 147.32,26.67 147.32,41.91 143.51,45.72 143.51,58.42 144.78,59.69 149.86,59.69 IC27.4
  Bottom 0.152: IC22.2 152.4,20.32 152.4,21.59 v149.86,21.59
N$12  (1 unrouted)
N$13  (via drill 0.33)
  Top 0.152: IC22.7 148.59,5.08 147.32,3.81 130.81,3.81 130.81,19.05 133.35,21.59 140.97,21.59 140.97,25.4 137.16,29.21 v137.16,44.45 | v132.08,45.72 130.81,46.99 v130.81,52.07
  Bottom 0.152: v137.16,44.45 135.89,45.72 v132.08,45.72 | v130.81,52.07 148.59,52.07 IC27.8
N$14  (via drill 0.33)
  Top 0.152: IC23.7 140.97,50.8 v140.97,62.23
  Bottom 0.152: v140.97,62.23 156.21,62.23 IC27.17
N$15  (via drill 0.33)
  Top 0.152: v154.94,53.34 v154.94,49.53
  Bottom 0.152: IC23.6 143.51,50.8 144.78,49.53 v154.94,49.53 | IC27.15 v154.94,53.34
N$16
  Bottom 0.152: IC23.2 143.51,60.96 144.78,59.69 153.67,59.69 156.21,57.15 153.67,54.61 153.67,50.8 IC27.13
N$17  (via drill 0.33)
  Top 0.152: v142.24,44.45 v142.24,58.42
  Bottom 0.152: v142.24,58.42 IC23.3 | v142.24,44.45 156.21,44.45 IC27.11
N$19  (via drill 0.33)
  Top 0.152: v82.55,45.72 83.82,44.45 v83.82,10.16 | v91.44,10.16 92.71,11.43 102.87,11.43 v102.87,19.05 | 130.81,20.32 133.35,22.86 IC24.19 | 130.81,20.32 v129.54,19.05 | IC24.1 130.81,21.59 130.81,20.32
  Bottom 0.152: IC29.8 77.47,45.72 v82.55,45.72 | v91.44,10.16 v83.82,10.16 | v129.54,19.05 v102.87,19.05
N$25  (via drill 0.33)
  Top 0.152: v73.66,44.45 IC29.6 | v96.52,44.45 99.06,41.91 99.06,36.83 100.33,35.56 v100.33,30.48 | IC25.1 v135.89,27.94
  Bottom 0.152: IC25.19 140.97,22.86 IC25.1 | v96.52,44.45 v73.66,44.45 | v100.33,30.48 110.49,30.48 111.76,31.75 120.65,31.75 124.46,27.94 v135.89,27.94
N$26  (via drill 0.33)
  Top 0.152: IC29.10 71.12,58.42 v74.93,62.23 | v127,63.5 128.27,64.77 v128.27,67.31
  Bottom 0.152: v74.93,62.23 76.2,63.5 v127,63.5 | v128.27,67.31 129.54,68.58 IC27.1 151.13,67.31 156.21,67.31 IC27.19
PC0  (via drill 0.33)
  Top 0.152: IC20.3 123.19,39.37 v123.19,25.4
  Bottom 0.152: IC25.2 137.16,24.13 128.27,24.13 IC24.2 125.73,22.86 v123.19,25.4
PC1  (via drill 0.33)
  Top 0.152: v119.38,44.45 116.84,41.91 116.84,36.83 v114.3,34.29 | v101.6,16.51 v101.6,35.56
  Bottom 0.152: IC25.4 137.16,16.51 133.35,16.51 132.08,17.78 IC24.4 123.19,17.78 121.92,16.51 v101.6,16.51 | v119.38,44.45 IC20.2 | v114.3,34.29 109.22,34.29 107.95,35.56 v101.6,35.56
PC2  (via drill 0.33)
  Top 0.152: v121.92,34.29 121.92,15.24 124.46,12.7 IC24.6
  Bottom 0.152: IC24.6 132.08,12.7 133.35,11.43 135.89,11.43 137.16,12.7 IC25.6 | v121.92,34.29 IC20.6
PC3  (via drill 0.33)
  Top 0.152: v115.57,33.02 114.3,31.75 111.76,31.75 109.22,29.21 109.22,3.81 111.76,1.27 124.46,1.27 124.46,5.08 IC24.8
  Bottom 0.152: IC24.8 132.08,7.62 133.35,6.35 137.16,6.35 IC25.8 | IC20.7 124.46,33.02 v115.57,33.02
PC4  (via drill 0.33)
  Top 0.152: v116.84,5.08 v116.84,35.56 | v129.54,3.81 130.81,2.54 IC24.11
  Bottom 0.152: IC24.11 135.89,1.27 144.78,1.27 IC25.11 | IC21.3 148.59,35.56 v116.84,35.56 | v116.84,5.08 118.11,3.81 v129.54,3.81
PC5  (via drill 0.33)
  Top 0.152: v144.78,16.51 143.51,15.24 143.51,13.97 142.24,12.7 142.24,11.43 IC25.13
  Bottom 0.152: IC24.13 135.89,8.89 144.78,8.89 IC25.13 | IC21.2 151.13,39.37 154.94,35.56 154.94,16.51 v144.78,16.51
PC6  (via drill 0.33)
  Top 0.152: v144.78,27.94 142.24,25.4 142.24,13.97 139.7,11.43 134.62,11.43 IC24.15
  Bottom 0.152: IC24.15 135.89,13.97 139.7,13.97 140.97,12.7 IC25.15 | IC21.6 148.59,27.94 v144.78,27.94
PC7  (via drill 0.33)
  Top 0.152: v144.78,26.67 143.51,25.4 143.51,20.32 IC25.17
  Bottom 0.152: IC24.17 135.89,19.05 139.7,19.05 140.97,17.78 IC25.17 | v144.78,26.67 IC21.7
PCAOUT  (via drill 0.33)
  Top 0.152: IC3.15 57.15,2.54 58.42,1.27 63.5,1.27 v63.5,5.08 | v68.58,5.08 68.58,36.83 IC29.5
  Bottom 0.152: v68.58,5.08 v63.5,5.08
PCDOUT  (1 unrouted)
R0DATA0
  Bottom 0.152: REG-0.2 3.81,95.25 11.43,95.25 12.7,93.98 IC10.2 16.51,93.98 17.78,95.25 22.86,95.25 24.13,93.98 IC11.2
R0DATA1  (via drill 0.33)
  Top 0.152: v11.43,87.63 13.97,87.63 IC10.4 13.97,90.17 22.86,90.17 24.13,88.9 IC11.4
  Bottom 0.152: REG-0.5 3.81,87.63 v11.43,87.63
R0DATA2
  Bottom 0.152: REG-0.6 3.81,85.09 11.43,85.09 12.7,83.82 IC10.6 17.78,83.82 19.05,82.55 22.86,82.55 24.13,83.82 IC11.6
R0DATA3
  Bottom 0.152: REG-0.9 5.08,78.74 7.62,78.74 8.89,80.01 12.7,80.01 | IC10.8 12.7,80.01 | IC11.8 24.13,78.74 22.86,80.01 12.7,80.01
R0DATA4  (via drill 0.33)
  Top 0.152: v27.94,74.93 21.59,74.93 IC10.11
  Bottom 0.152: IC10.11 20.32,74.93 12.7,74.93 11.43,76.2 REG-0.12 | IC11.11 31.75,74.93 v27.94,74.93
R0DATA5  (via drill 0.33)
  Top 0.152: IC10.13 22.86,78.74 v24.13,80.01 | REG-0.15 7.62,86.36 v7.62,97.79 | v25.4,99.06 27.94,96.52 27.94,88.9 29.21,87.63 29.21,83.82 30.48,82.55 30.48,81.28 IC11.13
  Bottom 0.152: v24.13,80.01 29.21,80.01 30.48,78.74 IC11.13 | v7.62,97.79 8.89,99.06 v25.4,99.06
R0DATA6
  Bottom 0.152: 20.32,85.09 IC10.15 | 20.32,85.09 12.7,85.09 11.43,86.36 REG-0.16 | IC11.15 27.94,83.82 26.67,85.09 20.32,85.09
R0DATA7  (via drill 0.33)
  Top 0.152: REG-0.19 11.43,93.98 12.7,92.71 19.05,92.71 v19.05,91.44
  Bottom 0.152: IC11.17 31.75,90.17 22.86,90.17 IC10.17 v19.05,91.44
R1DATA0
  Bottom 0.152: REG-1.2 41.91,93.98 43.18,95.25 45.72,95.25 46.99,93.98 IC12.2 49.53,93.98 50.8,95.25 57.15,95.25 58.42,93.98 IC13.2
R1DATA1  (via drill 0.33)
  Top 0.152: v45.72,87.63 46.99,88.9 IC12.4
  Bottom 0.152: REG-1.5 38.1,87.63 v45.72,87.63 | IC13.4 58.42,88.9 57.15,87.63 52.07,87.63 50.8,88.9 IC12.4
R1DATA2  (via drill 0.33)
  Top 0.152: v41.91,85.09 48.26,85.09 IC12.6
  Bottom 0.152: REG-1.6 40.64,83.82 v41.91,85.09 | IC13.6 58.42,83.82 57.15,82.55 52.07,82.55 50.8,83.82 IC12.6
R1DATA3  (via drill 0.33)
  Top 0.152: v45.72,77.47 48.26,77.47 IC12.8
  Bottom 0.152: REG-1.9 41.91,76.2 43.18,77.47 v45.72,77.47 | IC13.8 58.42,78.74 57.15,80.01 54.61,80.01 53.34,78.74 IC12.8
R1DATA4  (via drill 0.33)
  Top 0.152: IC12.11 v58.42,71.12
  Bottom 0.152: IC12.11 50.8,73.66 49.53,74.93 46.99,74.93 45.72,76.2 REG-1.12 | IC13.11 64.77,71.12 v58.42,71.12
R1DATA5  (via drill 0.33)
  Top 0.152: IC12.13 57.15,78.74 v58.42,80.01 60.96,80.01 62.23,78.74 62.23,74.93 v57.15,74.93 | REG-1.15 45.72,83.82 46.99,82.55 50.8,82.55 v50.8,76.2
  Bottom 0.152: v58.42,80.01 66.04,80.01 IC13.13 | v50.8,76.2 52.07,74.93 v57.15,74.93
R1DATA6  (via drill 0.33)
  Top 0.152: REG-1.16 45.72,86.36 46.99,87.63 v49.53,87.63
  Bottom 0.152: 57.15,85.09 IC12.15 | 57.15,85.09 63.5,85.09 64.77,83.82 IC13.15 | v49.53,87.63 52.07,85.09 57.15,85.09
R1DATA7
  Bottom 0.152: IC12.17 57.15,90.17 63.5,90.17 | 63.5,90.17 66.04,90.17 IC13.17 | REG-1.19 45.72,92.71 60.96,92.71 63.5,90.17
R2DATA0  (1 unrouted)
  Bottom 0.152: REG-2.2 76.2,93.98 77.47,95.25 80.01,95.25 81.28,93.98 IC14.2
R2DATA1  (via drill 0.33)
  Top 0.152: v97.79,90.17 v100.33,92.71 | v85.09,90.17 82.55,90.17 IC14.4
  Bottom 0.152: REG-2.5 74.93,90.17 80.01,90.17 81.28,88.9 IC14.4 | IC16.4 115.57,90.17 111.76,90.17 109.22,92.71 v100.33,92.71 | v85.09,90.17 v97.79,90.17
R2DATA2  (via drill 0.33)
  Top 0.152: v80.01,85.09 82.55,85.09 IC14.6 | IC16.6 115.57,83.82 114.3,82.55 109.22,82.55 109.22,77.47 106.68,74.93 v100.33,74.93 | v86.36,68.58 v86.36,74.93 | v73.66,67.31 73.66,81.28 REG-2.6
  Bottom 0.152: REG-2.6 76.2,83.82 77.47,85.09 v80.01,85.09 | v86.36,74.93 v100.33,74.93 | v86.36,68.58 85.09,67.31 v73.66,67.31
R2DATA3  (via drill 0.33)
  Top 0.152: v107.95,80.01 107.95,81.28 106.68,82.55 97.79,82.55 v97.79,87.63 | v87.63,71.12 v87.63,87.63 | v78.74,68.58 76.2,71.12 v76.2,72.39
  Bottom 0.152: 76.2,76.2 REG-2.9 | 76.2,76.2 77.47,77.47 81.28,77.47 IC14.8 | IC16.8 115.57,80.01 v107.95,80.01 | v87.63,87.63 v97.79,87.63 | v87.63,71.12 85.09,68.58 v78.74,68.58 | 76.2,76.2 v76.2,72.39
R2DATA4  (via drill 0.33)
  Top 0.152: IC14.11 88.9,72.39 88.9,68.58 | 88.9,68.58 86.36,66.04 85.09,66.04 85.09,73.66 83.82,74.93 78.74,74.93 REG-2.12 | IC16.11 121.92,71.12 v121.92,66.04 | v93.98,67.31 92.71,68.58 88.9,68.58
  Bottom 0.152: v121.92,66.04 96.52,66.04 95.25,67.31 v93.98,67.31
R2DATA5  (via drill 0.33)
  Top 0.152: v86.36,82.55 v86.36,78.74 | v107.95,77.47 107.95,78.74 106.68,80.01 v100.33,80.01
  Bottom 0.152: v86.36,78.74 IC14.13 91.44,78.74 92.71,80.01 v100.33,80.01 | v86.36,82.55 83.82,85.09 81.28,85.09 80.01,83.82 REG-2.15 | IC16.13 119.38,78.74 118.11,77.47 v107.95,77.47
R2DATA6  (via drill 0.33)
  Top 0.152: v102.87,85.09 109.22,85.09 109.22,90.17 111.76,92.71 118.11,92.71 121.92,88.9 121.92,86.36 IC16.15 | REG-2.16 80.01,86.36 v81.28,87.63 | v86.36,83.82 v86.36,87.63
  Bottom 0.152: v102.87,85.09 92.71,85.09 91.44,83.82 IC14.15 v86.36,83.82 | v86.36,87.63 v81.28,87.63
R2DATA7  (via drill 0.33)  (1 unrouted)
  Top 0.152: v81.28,90.17 76.2,90.17 76.2,91.44 REG-2.19
  Bottom 0.152: IC14.17 85.09,88.9 83.82,90.17 v81.28,90.17
R3DATA0
  Bottom 0.152: IC15.2 95.25,95.25 102.87,95.25 104.14,93.98 REG-3.2 106.68,93.98 107.95,95.25 127,95.25 IC17.2
R3DATA1  (via drill 0.33)
  Top 0.152: v110.49,87.63 v110.49,90.17
  Bottom 0.152: IC15.4 99.06,88.9 100.33,90.17 v110.49,90.17 | REG-3.5 109.22,86.36 v110.49,87.63 118.11,87.63 120.65,90.17 125.73,90.17 127,88.9 IC17.4
R3DATA2
  Bottom 0.152: IC15.6 99.06,83.82 100.33,82.55 104.14,82.55 REG-3.6 110.49,83.82 111.76,85.09 125.73,85.09 127,83.82 IC17.6
R3DATA3  (via drill 0.33)
  Top 0.152: v102.87,77.47 105.41,77.47 REG-3.9 | v133.35,78.74 134.62,77.47 140.97,77.47 140.97,63.5 v139.7,62.23 | v114.3,58.42 111.76,60.96 113.03,62.23 113.03,69.85 109.22,73.66 v109.22,76.2
  Bottom 0.152: IC15.8 99.06,78.74 100.33,77.47 v102.87,77.47 | v133.35,78.74 IC17.8 | v139.7,62.23 137.16,62.23 133.35,58.42 v114.3,58.42 | REG-3.9 v109.22,76.2
R3DATA4  (via drill 0.33)
  Top 0.152: IC17.11 137.16,72.39 137.16,64.77 135.89,63.5 v135.89,50.8 | v123.19,50.8 123.19,48.26 121.92,46.99 v121.92,40.64 | v104.14,39.37 102.87,40.64 102.87,72.39 IC15.11
  Bottom 0.152: IC15.11 102.87,74.93 109.22,74.93 110.49,76.2 REG-3.12 | v123.19,50.8 v135.89,50.8 | v121.92,40.64 120.65,39.37 v104.14,39.37
R3DATA5  (via drill 0.33)
  Top 0.152: v127,77.47 121.92,77.47 v121.92,80.01 | v119.38,82.55 v119.38,80.01
  Bottom 0.152: IC15.13 102.87,80.01 106.68,80.01 109.22,82.55 111.76,82.55 | REG-3.15 111.76,82.55 | IC17.13 134.62,77.47 v127,77.47 | v119.38,80.01 v121.92,80.01 | 111.76,82.55 v119.38,82.55
R3DATA6  (via drill 0.33)
  Top 0.152: v121.92,82.55 v127,82.55 | v119.38,83.82 118.11,85.09 113.03,85.09 REG-3.16
  Bottom 0.152: IC15.15 102.87,83.82 104.14,85.09 110.49,85.09 111.76,86.36 REG-3.16 | IC17.15 134.62,82.55 v127,82.55 | v121.92,82.55 120.65,83.82 v119.38,83.82
R3DATA7  (via drill 0.33)
  Top 0.152: IC15.17 102.87,88.9 104.14,90.17 107.95,90.17 110.49,92.71 | 110.49,92.71 111.76,93.98 REG-3.19 | IC17.17 138.43,91.44 v138.43,96.52 | 110.49,92.71 v110.49,99.06
  Bottom 0.152: v138.43,96.52 135.89,99.06 v110.49,99.06
RAOUT0  (via drill 0.33)
  Top 0.152: v27.94,29.21 v27.94,10.16
  Bottom 0.152: v27.94,10.16 IC2.11 | v27.94,29.21 25.4,31.75 16.51,31.75 11.43,36.83 6.35,36.83 IC18.1
RAOUT1  (via drill 0.33)
  Top 0.152: IC2.12 24.13,5.08 22.86,3.81 11.43,3.81 v11.43,34.29 | v10.16,35.56 8.89,36.83 IC18.3
  Bottom 0.152: v10.16,35.56 v11.43,34.29
RAOUT2
  Top 0.152: IC2.13 20.32,5.08 19.05,6.35 13.97,6.35 IC18.5
RAOUT3  (1 unrouted)
RDIN0  (1 unrouted)
RDIN1  (1 unrouted)
RDIN2  (1 unrouted)
RDIN3  (1 unrouted)
RDOUT0  (1 unrouted)
RDOUT1  (1 unrouted)
RDOUT2  (1 unrouted)
RDOUT3  (1 unrouted)
RESET  (1 unrouted)
RSTUC  (1 unrouted)
S0  (via drill 0.33)
  Top 0.152: UCPC-.3 27.94,30.48 26.67,29.21 v26.67,12.7
  Bottom 0.152: IC30.10 96.52,12.7 95.25,13.97 82.55,13.97 81.28,12.7 IC5.10 77.47,12.7 76.2,13.97 73.66,13.97 72.39,12.7 IC4.10 58.42,12.7 57.15,13.97 54.61,13.97 53.34,12.7 IC3.10 39.37,12.7 38.1,13.97 35.56,13.97 34.29,12.7 v26.67,12.7 IC2.10 20.32,12.7 19.05,13.97 3.81,13.97 IC1.10
S1  (via drill 0.33)
  Top 0.152: UCPC-.4 29.21,38.1 v29.21,15.24
  Bottom 0.152: IC30.9 96.52,15.24 95.25,16.51 81.28,16.51 80.01,15.24 IC5.9 77.47,15.24 76.2,16.51 73.66,16.51 72.39,15.24 IC4.9 58.42,15.24 57.15,16.51 54.61,16.51 53.34,15.24 IC3.9 39.37,15.24 38.1,16.51 35.56,16.51 34.29,15.24 v29.21,15.24 IC2.9 20.32,15.24 19.05,16.51 3.81,16.51 IC1.9
S2  (via drill 0.33)
  Top 0.152: v33.02,17.78 UCPC-.5
  Bottom 0.152: 77.47,19.05 60.96,19.05 IC4.8 58.42,19.05 54.61,19.05 53.34,17.78 IC3.8 39.37,19.05 35.56,19.05 34.29,17.78 v33.02,17.78 IC2.8 20.32,17.78 19.05,19.05 3.81,19.05 IC1.8 | IC5.8 77.47,19.05 | IC30.8 96.52,17.78 95.25,19.05 77.47,19.05
S3  (via drill 0.33)
  Top 0.152: UCPC-.13 25.4,41.91 24.13,40.64 v24.13,38.1 | v15.24,20.32 16.51,19.05 21.59,19.05 IC2.7 24.13,17.78 24.13,12.7 25.4,11.43 25.4,1.27 41.91,1.27 43.18,2.54 43.18,5.08 | 43.18,17.78 IC3.7 | 43.18,5.08 43.18,17.78 | UCPC-.6 34.29,38.1 v34.29,34.29 | v44.45,34.29 44.45,19.05 43.18,17.78 | v49.53,20.32 49.53,7.62 46.99,5.08 43.18,5.08
  Bottom 0.152: IC30.7 96.52,20.32 95.25,21.59 92.71,21.59 91.44,20.32 IC5.7 77.47,20.32 76.2,21.59 73.66,21.59 72.39,20.32 IC4.7 58.42,20.32 57.15,21.59 54.61,21.59 53.34,20.32 v49.53,20.32 | v24.13,38.1 25.4,36.83 33.02,36.83 UCPC-.6 | v15.24,20.32 IC1.7 | v44.45,34.29 v34.29,34.29
S4
  Top 0.152: UCPC-.11 34.29,43.18 39.37,43.18 39.37,38.1 40.64,36.83 43.18,36.83 43.18,25.4 IC3.6
  Bottom 0.152: IC30.6 96.52,22.86 95.25,24.13 92.71,24.13 91.44,22.86 IC5.6 77.47,22.86 76.2,24.13 73.66,24.13 72.39,22.86 IC4.6 58.42,22.86 57.15,24.13 54.61,24.13 53.34,22.86 IC3.6 39.37,22.86 38.1,24.13 35.56,24.13 34.29,22.86 IC2.6 20.32,22.86 19.05,24.13 3.81,24.13 IC1.6
S5  (1 unrouted)
  Bottom 0.152: IC30.5 96.52,25.4 95.25,26.67 92.71,26.67 91.44,25.4 IC5.5 77.47,25.4 76.2,26.67 73.66,26.67 72.39,25.4 IC4.5 58.42,25.4 57.15,26.67 54.61,26.67 53.34,25.4 IC3.5 39.37,25.4 38.1,26.67 35.56,26.67 34.29,25.4 IC2.5 20.32,25.4 19.05,26.67 3.81,26.67 IC1.5
S6  (via drill 0.33)
  Top 0.152: v45.72,55.88 v45.72,59.69 | v40.64,38.1 v40.64,55.88 | v49.53,27.94 v49.53,36.83
  Bottom 0.152: IC1.4 3.81,29.21 20.32,29.21 IC2.4 27.94,27.94 29.21,29.21 39.37,29.21 IC3.4 v49.53,27.94 52.07,27.94 53.34,29.21 58.42,29.21 IC4.4 72.39,27.94 73.66,29.21 77.47,29.21 IC5.4 88.9,27.94 90.17,29.21 96.52,29.21 IC30.4 | INS-REG.5 44.45,59.69 v45.72,59.69 | v40.64,55.88 v45.72,55.88 | v40.64,38.1 41.91,36.83 v49.53,36.83
S7  (via drill 0.33)
  Top 0.152: IC1.3 5.08,30.48 v5.08,31.75 | IC2.3 21.59,31.75 v15.24,31.75 v15.24,34.29 | IC30.3 96.52,30.48 95.25,29.21 91.44,29.21 v91.44,30.48 | v64.77,30.48 v64.77,59.69 | v31.75,31.75 v31.75,34.29
  Bottom 0.152: v15.24,31.75 v5.08,31.75 | v91.44,30.48 IC5.3 77.47,31.75 68.58,31.75 67.31,30.48 v64.77,30.48 IC4.3 58.42,30.48 57.15,31.75 54.61,31.75 53.34,30.48 IC3.3 39.37,31.75 v31.75,31.75 | INS-REG.6 46.99,59.69 v64.77,59.69 | v31.75,34.29 v15.24,34.29
S8  (via drill 0.33)
  Top 0.152: INS-REG.9 52.07,58.42 53.34,57.15 57.15,57.15 v57.15,63.5 | v74.93,63.5 76.2,62.23 76.2,49.53 v77.47,48.26 | v85.09,26.67 v85.09,46.99
  Bottom 0.152: IC1.25 19.05,27.94 20.32,26.67 34.29,26.67 35.56,27.94 IC2.25 38.1,27.94 39.37,26.67 52.07,26.67 53.34,27.94 IC3.25 57.15,27.94 58.42,26.67 72.39,26.67 73.66,27.94 IC4.25 76.2,27.94 77.47,26.67 v85.09,26.67 88.9,26.67 90.17,27.94 IC5.25 95.25,27.94 96.52,26.67 99.06,26.67 100.33,27.94 IC30.25 | v74.93,63.5 v57.15,63.5 | v77.47,48.26 78.74,46.99 v85.09,46.99
S9  (1 unrouted)
  Bottom 0.152: IC30.24 111.76,24.13 96.52,24.13 95.25,25.4 IC5.24 92.71,25.4 91.44,24.13 77.47,24.13 76.2,25.4 IC4.24 73.66,25.4 72.39,24.13 58.42,24.13 57.15,25.4 IC3.24 54.61,25.4 53.34,24.13 39.37,24.13 38.1,25.4 IC2.24 35.56,25.4 34.29,24.13 20.32,24.13 19.05,25.4 IC1.24
S10  (1 unrouted)
  Bottom 0.152: IC1.21 19.05,17.78 20.32,16.51 34.29,16.51 35.56,17.78 IC2.21 38.1,17.78 39.37,16.51 53.34,16.51 54.61,17.78 IC3.21 57.15,17.78 58.42,16.51 60.96,16.51 62.23,17.78 IC4.21 76.2,17.78 77.47,16.51 80.01,16.51 81.28,17.78 IC5.21 95.25,17.78 96.52,16.51 99.06,16.51 100.33,17.78 IC30.21
S11  (1 unrouted)
  Bottom 0.152: IC1.23 19.05,22.86 20.32,21.59 34.29,21.59 35.56,22.86 IC2.23 38.1,22.86 39.37,21.59 53.34,21.59 54.61,22.86 IC3.23 57.15,22.86 58.42,21.59 72.39,21.59 73.66,22.86 IC4.23 76.2,22.86 77.47,21.59 91.44,21.59 92.71,22.86 IC5.23 95.25,22.86 96.52,21.59 99.06,21.59 100.33,22.86 IC30.23
S12  (via drill 0.33)
  Top 0.152: v15.24,30.48 16.51,29.21 24.13,29.21 | 24.13,29.21 24.13,30.48 IC2.2 | INS-REG.19 36.83,67.31 36.83,66.04 38.1,64.77 38.1,58.42 36.83,57.15 v36.83,53.34 | v46.99,44.45 48.26,43.18 v48.26,33.02 46.99,31.75 46.99,8.89 v44.45,6.35 | 24.13,29.21 25.4,27.94 25.4,12.7 26.67,11.43 v26.67,7.62
  Bottom 0.152: IC1.2 5.08,30.48 v15.24,30.48 | IC3.2 v48.26,33.02 53.34,33.02 54.61,34.29 58.42,34.29 | IC4.2 58.42,34.29 | 77.47,34.29 IC5.2 | 58.42,34.29 77.47,34.29 | v36.83,53.34 38.1,52.07 41.91,52.07 45.72,48.26 45.72,45.72 v46.99,44.45 | IC30.2 96.52,34.29 77.47,34.29 | v26.67,7.62 27.94,6.35 v44.45,6.35
SPAOUT
  Top 0.152: IC4.17 69.85,7.62 69.85,35.56 72.39,38.1 72.39,40.64 68.58,44.45 IC29.11
VCC  (via drill 0.33)
  Top 0.152: IC23.16 146.05,77.47 147.32,78.74 | 147.32,78.74 157.48,78.74 IC27.20 | v29.21,96.52 v29.21,93.98 | IC15.20 99.06,99.06 90.17,99.06 IC14.20 | v64.77,95.25 67.31,95.25 IC13.20 | 147.32,78.74 139.7,86.36 139.7,96.52 138.43,97.79 135.89,97.79 IC17.20 | IC2.27 IC2.28 IC3.1 | v41.91,41.91 IC9.14 | IC3.27 IC3.28 IC4.1 59.69,40.64 60.96,41.91 IC29.14 | IC18.14 2.54,48.26 2.54,57.15 | IC19.14 2.54,57.15 | IC7.20 3.81,64.77 2.54,63.5 2.54,57.15 | IC2.1 IC1.28 | UCPC-.14 20.32,44.45 v20.32,43.18 | INS-REG.20 31.75,64.77 33.02,63.5 33.02,54.61 v27.94,49.53 | v139.7,46.99 140.97,45.72 v140.97,40.64 140.97,33.02 146.05,27.94 IC25.20 | IC22.16 154.94,22.86 154.94,39.37 IC21.16 157.48,43.18 153.67,46.99 v153.67,68.58 | IC4.27 IC4.28 IC5.1 | IC30.28 IC30.27 | IC5.27 IC5.28 IC30.1
  Bottom 0.152: IC26.20 107.95,69.85 109.22,71.12 113.03,71.12 114.3,69.85 IC6.20 119.38,71.12 130.81,71.12 IC8.14 156.21,69.85 IC27.20 v153.67,68.58 | REG-0.20 11.43,96.52 12.7,95.25 16.51,95.25 17.78,96.52 IC10.20 22.86,96.52 24.13,95.25 27.94,95.25 v29.21,93.98 | v29.21,96.52 IC11.20 34.29,95.25 41.91,95.25 43.18,96.52 REG-1.20 45.72,96.52 46.99,95.25 49.53,95.25 50.8,96.52 IC12.20 57.15,96.52 58.42,95.25 v64.77,95.25 | IC17.20 134.62,97.79 127,97.79 125.73,96.52 IC16.20 120.65,96.52 119.38,97.79 114.3,97.79 REG-3.20 107.95,96.52 106.68,95.25 104.14,95.25 102.87,96.52 IC15.20 | IC13.20 68.58,95.25 76.2,95.25 77.47,96.52 REG-2.20 80.01,96.52 81.28,95.25 88.9,95.25 IC14.20 | v41.91,41.91 39.37,39.37 39.37,35.56 IC3.1 IC3.28 | v20.32,43.18 17.78,40.64 17.78,36.83 | IC1.28 17.78,36.83 | v27.94,49.53 25.4,49.53 UCPC-.14 | IC18.14 8.89,41.91 11.43,41.91 12.7,40.64 12.7,36.83 17.78,36.83 | IC2.1 IC2.28 | IC24.20 137.16,27.94 142.24,27.94 144.78,25.4 IC25.20 | v139.7,46.99 IC20.16 | IC30.27 100.33,33.02 IC30.1 | IC5.28 IC5.1 | IC21.16 156.21,40.64 v140.97,40.64 123.19,40.64 119.38,36.83 114.3,36.83 IC30.28 | IC4.28 IC4.1